# EAGLE design dongle (EAGLE 6.4)
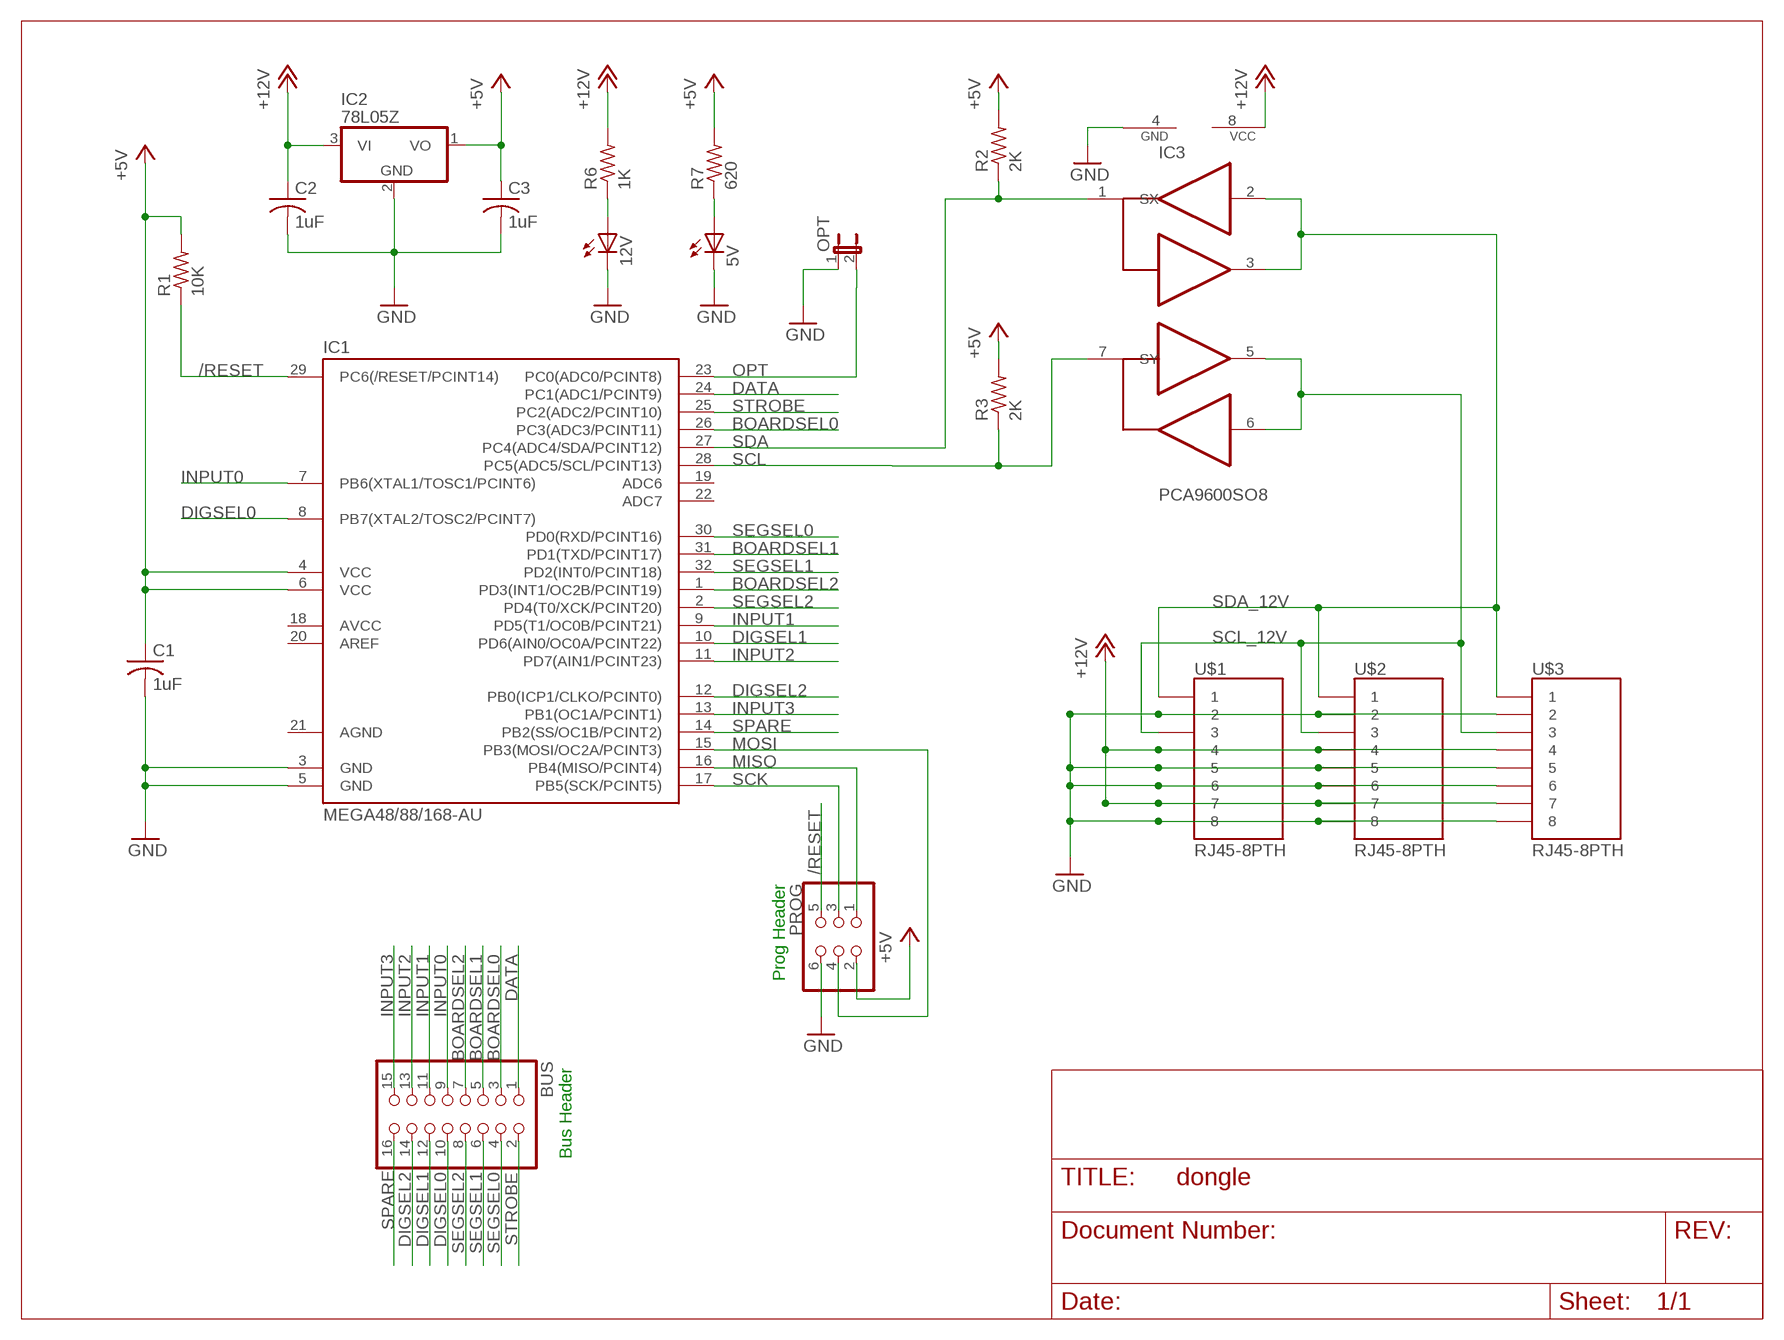
[diagram p0: schematic, sheet 1]

## Parts
5V  LED3MM  [LED3MM]
12V  LED3MM  [LED3MM]
BUS  PINHD-2X8  [2X08]
C1  1uF  C-US025-025X050  [C025-025X050]
C2  1uF  C-US025-025X050  [C025-025X050]
C3  1uF  C-US025-025X050  [C025-025X050]
IC1  MEGA48/88/168-AU  [TQFP32-08]
IC2  78L05Z  [TO92]
IC3  PCA9600SO8  [SO08]
OPT  JUMPER-2PTH  [1X02]
PROG  PINHD-2X3  [2X03]
R1  10K  R-US_0204/5  [0204/5]
R2  2K  R-US_0204/5  [0204/5]
R3  2K  R-US_0204/5  [0204/5]
R6  1K  R-US_0204/5  [0204/5]
R7  620  R-US_0204/5  [0204/5]
U$1  RJ45-8PTH  [RJ45-8]
U$2  RJ45-8PTH  [RJ45-8]
U$3  RJ45-8PTH  [RJ45-8]

## Nets
+5V [power]: C1.1 C3.1 IC1.4(VCC) IC1.6(VCC) IC2.1(VO) PROG.2 R1.2 R2.2 R3.2 R7.2
+12V [power]: C2.1 IC2.3(VI) IC3.8(VCC) R6.2 U$1.4 U$1.7 U$2.4 U$2.7 U$3.4 U$3.7
/RESET: IC1.29(PC6(/RESET/PCINT14)) PROG.5 R1.1
BOARDSEL0: BUS.3 IC1.26(PC3(ADC3/PCINT11))
BOARDSEL1: BUS.5 IC1.31(PD1(TXD/PCINT17))
BOARDSEL2: BUS.7 IC1.1(PD3(INT1/OC2B/PCINT19))
DATA: BUS.1 IC1.24(PC1(ADC1/PCINT9))
DIGSEL0: BUS.10 IC1.8(PB7(XTAL2/TOSC2/PCINT7))
DIGSEL1: BUS.12 IC1.10(PD6(AIN0/OC0A/PCINT22))
DIGSEL2: BUS.14 IC1.12(PB0(ICP1/CLKO/PCINT0))
GND [power]: 5V.K(C) 12V.K(C) C1.2 C2.2 C3.2 IC1.3(GND) IC1.5(GND) IC2.2(GND) IC3.4(GND) OPT.1 PROG.6 U$1.2 U$1.5 U$1.6 U$1.8 U$2.2 U$2.5 U$2.6 U$2.8 U$3.2 U$3.5 U$3.6 U$3.8
INPUT0: BUS.9 IC1.7(PB6(XTAL1/TOSC1/PCINT6))
INPUT1: BUS.11 IC1.9(PD5(T1/OC0B/PCINT21))
INPUT2: BUS.13 IC1.11(PD7(AIN1/PCINT23))
INPUT3: BUS.15 IC1.13(PB1(OC1A/PCINT1))
MISO: IC1.16(PB4(MISO/PCINT4)) PROG.1
MOSI: IC1.15(PB3(MOSI/OC2A/PCINT3)) PROG.4
N$1: 5V.A R7.1
N$2: 12V.A R6.1
OPT: IC1.23(PC0(ADC0/PCINT8)) OPT.2
SCK: IC1.17(PB5(SCK/PCINT5)) PROG.3
SCL: IC1.28(PC5(ADC5/SCL/PCINT13)) IC3.7(SY) R3.1
SCL_12V: IC3.5(TY) IC3.6(RY) U$1.3 U$2.3 U$3.3
SDA: IC1.27(PC4(ADC4/SDA/PCINT12)) IC3.1(SX) R2.1
SDA_12V: IC3.2(RX) IC3.3(TX) U$1.1 U$2.1 U$3.1
SEGSEL0: BUS.4 IC1.30(PD0(RXD/PCINT16))
SEGSEL1: BUS.6 IC1.32(PD2(INT0/PCINT18))
SEGSEL2: BUS.8 IC1.2(PD4(T0/XCK/PCINT20))
SPARE: BUS.16 IC1.14(PB2(SS/OC1B/PCINT2))
STROBE: BUS.2 IC1.25(PC2(ADC2/PCINT10))
Unconnected: IC1.18(AVCC) IC1.19(ADC6) IC1.20(AREF) IC1.22(ADC7)

## Notes on the sheet
- Prog Header
- Bus Header

## Power pins joined to a net without a drawn wire
AGND: IC1.21(AGND)

## Library data of the parts
5V 12V = led:LED: LED OSRAM: - CHIPLED LG R971, LG N971, LY N971, LG Q971, LY Q971, LO R971, LY R971 LH N974, LH R974 LS Q976, LO Q976, LY Q976 LO Q996 - Hyper CHIPLED LW Q18S LB Q993, LB Q99A, LB R99A - SideLED LS A670, LO A670, LY A670, LG A670, LP A670 LB A673, LV A673, LT A673, LW A673 LH A674 LY A675 LS A676, LA A676, LO A676, LY A676, LW A676 LS A679, LY A679, LG A679 - Hyper Micro SIDELED® LS Y876, LA Y876, LO Y876, LY Y876 LT Y87S - SmartLED LW L88C, LW L88S LB L89C, LB L89S, LG L890 LS L89K, LO L89K, LY L89K LS L896, LA L896, LO L896, LY L896 - TOPLED LS T670, LO T670, LY T670, LG T670, LP T670 LSG T670, LSP T670, LSY T670, LOP T670, LYG T670 LG T671, LOG T671, LSG T671 LB T673, LV T673, LT T673, LW T673 LH T674 LS T676, LA T676, LO T676, LY T676, LB T676, LH T676, LSB T676, LW T676 LB T67C, LV T67C, LT T67C, LS T67K, LO T67K, LY T67K, LW E67C LS E67B, LA E67B, LO E67B, LY E67B, LB E67C, LV E67C, LT E67C LW T67C LS T679, LY T679, LG T679 LS T770, LO T770, LY T770, LG T770, LP T770 LB T773, LV T773, LT T773, LW T773 LH T774 LS E675, LA E675, LY E675, LS T675 LS T776, LA T776, LO T776, LY T776, LB T776 LHGB T686 LT T68C, LB T68C - Hyper Mini TOPLED® LB M676 - Mini TOPLED Santana® LG M470 LS M47K, LO M47K, LY M47K Source: http://www.osram.convergy.de LUXEON: - LUMILED® LXK2-PW12-R00, LXK2-PW12-S00, LXK2-PW14-U00, LXK2-PW14-V00 LXK2-PM12-R00, LXK2-PM12-S00, LXK2-PM14-U00 LXK2-PE12-Q00, LXK2-PE12-R00, LXK2-PE12-S00, LXK2-PE14-T00, LXK2-PE14-U00 LXK2-PB12-K00, LXK2-PB12-L00, LXK2-PB12-M00, LXK2-PB14-N00, LXK2-PB14-P00, LXK2-PB14-Q00 LXK2-PR12-L00, LXK2-PR12-M00, LXK2-PR14-Q00, LXK2-PR14-R00 LXK2-PD12-Q00, LXK2-PD12-R00, LXK2-PD12-S00 LXK2-PH12-R00, LXK2-PH12-S00 LXK2-PL12-P00, LXK2-PL12-Q00, LXK2-PL12-R00 Source: www.luxeon.com KINGBRIGHT: KA-3528ASYC Source: www.kingbright.com
BUS = pinhead:PINHD-2X8: PIN HEADER
C1-C3 = rcl:C-US: CAPACITOR, American symbol
IC1 = avr-4:MEGA48/88/168
IC2 = linear:78*: Positive VOLTAGE REGULATOR Source: http://cache.national.com/ds/LM/LM78L05.pdf http://www.fairchildsemi.com/ds/LM/LM7805.pdf
IC3 = 4534_I2C2:PCA9600: I2C ACTIVE TERMINATOR SO-8
OPT = SparkFun:JUMPER-2: Jumper Basic 0.1" spaced jumper. Use with breakaway headers.
PROG = pinhead:PINHD-2X3: PIN HEADER
R1-R3 R6 R7 = rcl:R-US_: RESISTOR, American symbol
U$1-U$3 = SparkFun:RJ45-8: RJ45 Jack Simple RJ45, 8-pin connection - connector for common Cat5, Cat5e, and Cat6 Ethernet cables. Footprint not yet proven in production. Connector sku is PRT-00643; Breakout PCB sku is BOB-00716.

## Net classes
0 default: width 0.152 mm, drill 0.152 mm, clearance 0.152 mm
1 power: width 0.305 mm, drill 0.305 mm, clearance 0.152 mm to class 0, clearance 0.152 mm

## Board
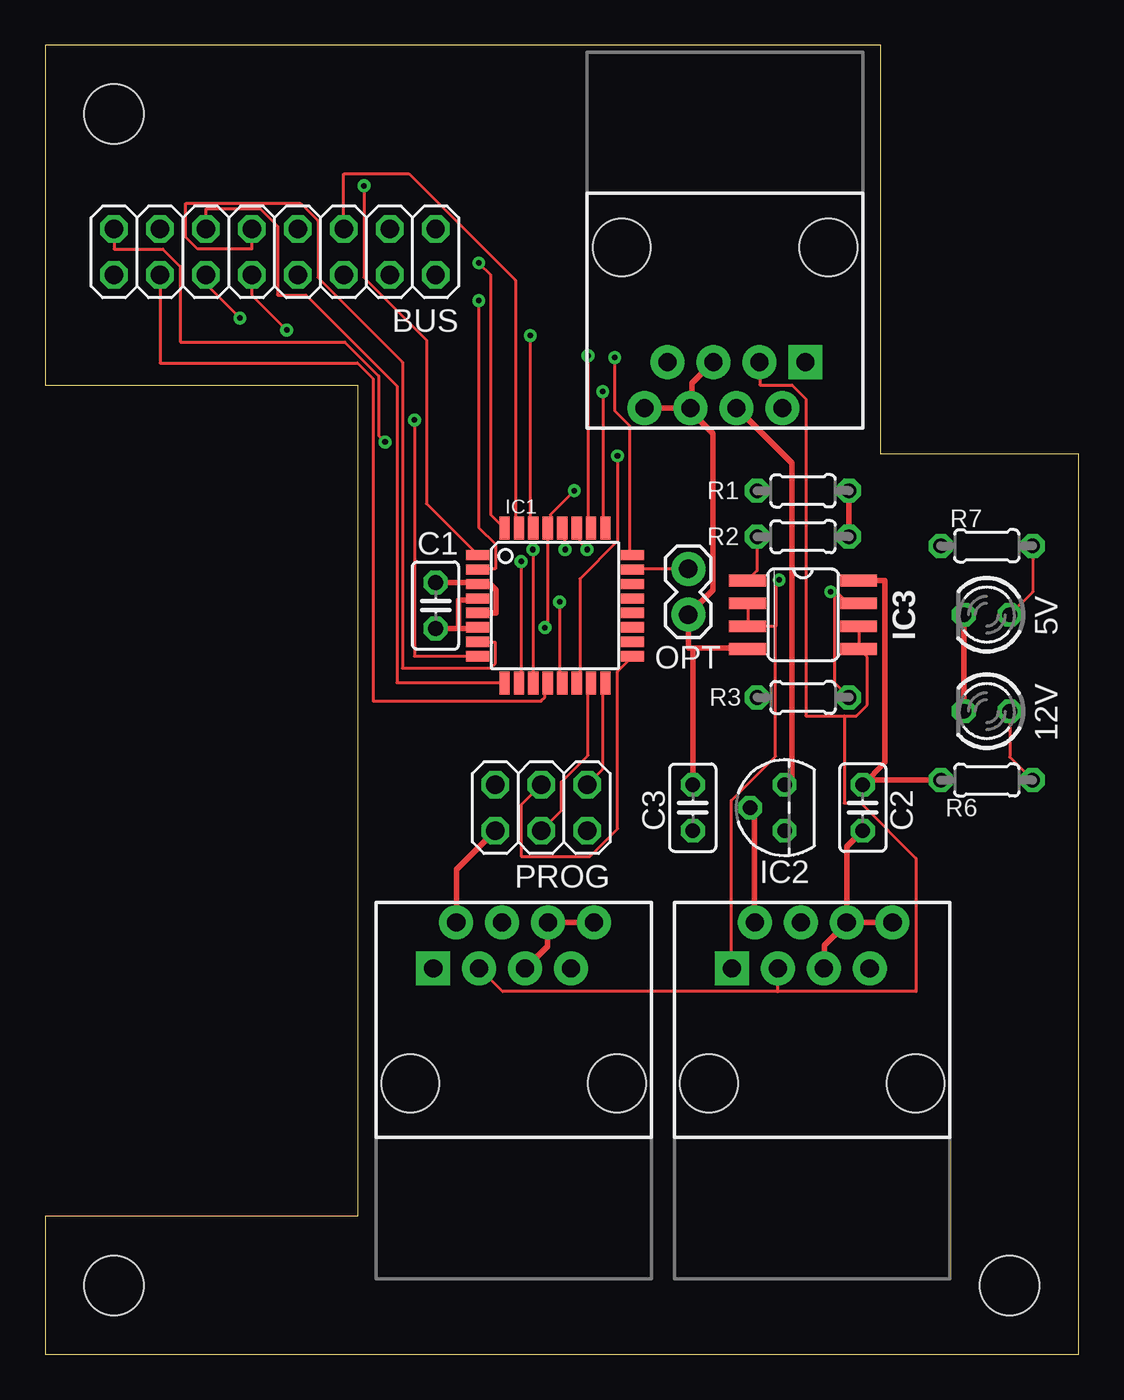
[diagram p1: board, top side]
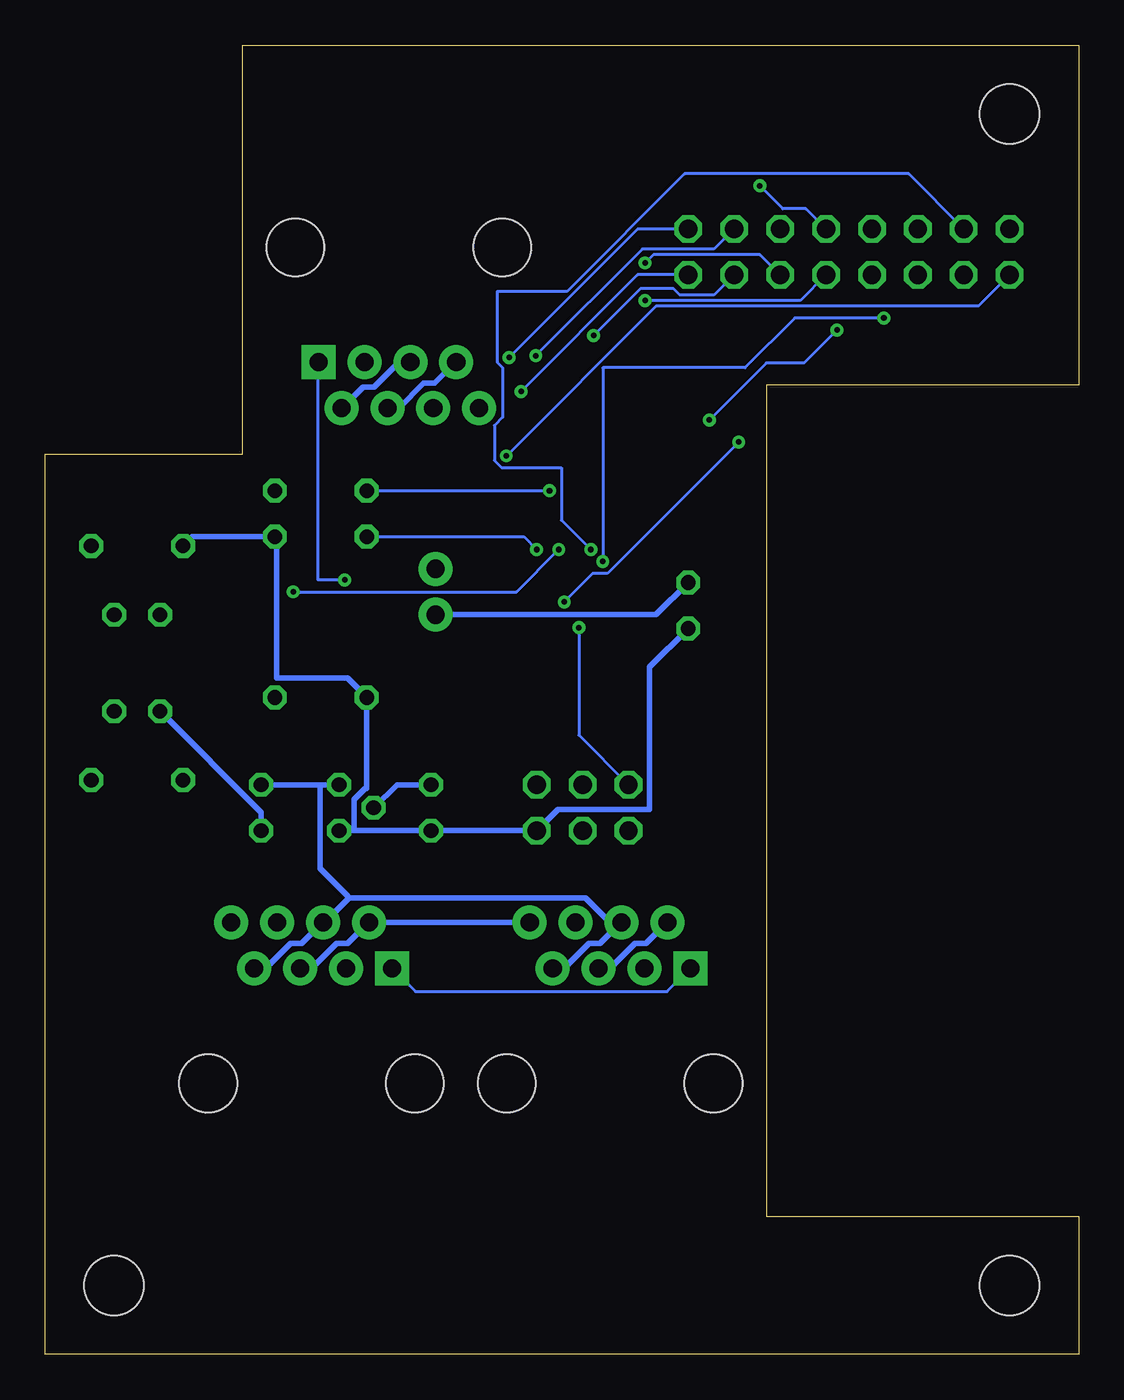
[diagram p2: board, bottom side, seen from below]

Size 57.15 x 72.39 mm. Coordinates in mm from the lower left corner, seen from the top.
Outline: 0,0 57.15,0 57.15,49.78 46.23,49.78 46.23,72.39 0,72.39 0,53.59 17.27,53.59 17.27,7.62 0,7.62 0,0
Copper layers (1*16): Top 0.035mm / dielectric 1.5mm / Bottom 0.035mm
Design rules "default *": minimum track width 6mil, minimum drill 12mil, track to track 6mil, track to pad 10mil, pad to pad 8mil, via to via 8mil, smd to smd 6mil, copper to edge 30mil, drill to drill 8mil, minimum pad ring 10mil, minimum via ring 8mil, stop-mask expansion 4mil, vias tented up to drill 0mil, thermal gap 10mil
vRestrict: area 2,57.7 to 23.6,64.3

### Footprints (pad centres in the part's own frame; a part is rotated, then mirrored left to right if it is on the bottom)
LED3MM = drill 0.813 octagon: A -1.27,0; K 1.27,0
2X08 = drill 1.016 octagon: 1 -8.89,-1.27; 2 -8.89,1.27; 3 -6.35,-1.27; 4 -6.35,1.27; 5 -3.81,-1.27; 6 -3.81,1.27; 7 -1.27,-1.27; 8 -1.27,1.27; 9 1.27,-1.27; 10 1.27,1.27; 11 3.81,-1.27; 12 3.81,1.27; 13 6.35,-1.27; 14 6.35,1.27; 15 8.89,-1.27; 16 8.89,1.27
C025-025X050 = drill 0.813 octagon: 1 -1.27,0; 2 1.27,0
TQFP32-08 = smd 1.27 x 0.559: 1 -4.293,2.8; 2 -4.293,2; 3 -4.293,1.2; 4 -4.293,0.4; 5 -4.293,-0.4; 6 -4.293,-1.2; 7 -4.293,-2; 8 -4.293,-2.8; 17 4.293,-2.8; 18 4.293,-2; 19 4.293,-1.2; 20 4.293,-0.4; 21 4.293,0.4; 22 4.293,1.2; 23 4.293,2; 24 4.293,2.8 | smd 0.559 x 1.27: 9 -2.8,-4.293; 10 -2,-4.293; 11 -1.2,-4.293; 12 -0.4,-4.293; 13 0.4,-4.293; 14 1.2,-4.293; 15 2,-4.293; 16 2.8,-4.293; 25 2.8,4.293; 26 2,4.293; 27 1.2,4.293; 28 0.4,4.293; 29 -0.4,4.293; 30 -1.2,4.293; 31 -2,4.293; 32 -2.8,4.293
TO92 = drill 0.813 octagon: 1 -1.27,0; 2 0,1.905; 3 1.27,0
SO08 = smd 0.66 x 2.032: 1 -1.905,-3.073; 2 -0.635,-3.073; 3 0.635,-3.073; 4 1.905,-3.073; 5 1.905,3.073; 6 0.635,3.073; 7 -0.635,3.073; 8 -1.905,3.073
1X02 = drill 1.016 pad 1.88: 1 0,0; 2 2.54,0
2X03 = drill 1.016 octagon: 1 -2.54,-1.27; 2 -2.54,1.27; 3 0,-1.27; 4 0,1.27; 5 2.54,-1.27; 6 2.54,1.27
0204/5 = drill 0.813 octagon: 1 -2.54,0; 2 2.54,0
RJ45-8 = drill 1 pad 1.88 square: 1 -4.445,6.35 | drill 1 pad 1.88: 2 -3.175,8.89; 3 -1.905,6.35; 4 -0.635,8.89; 5 0.635,6.35; 6 1.905,8.89; 7 3.175,6.35; 8 4.445,8.89 | hole 3.2: -5.715,0; 5.715,0
STAND-OFF = hole 3.302: 0,0

### Placement (x,y rotation side)
5V  52.07,40.89 180 top
12V  52.07,35.56 180 top
BUS  12.7,60.96 180 top
C1  21.59,41.4 90 top
C2  45.21,30.23 270 top
C3  35.81,30.23 90 top
IC1  28.19,41.4 0 top
IC2  40.89,30.23 90 top
IC3  41.91,40.89 270 top
OPT  35.56,40.89 90 top
PROG  27.43,30.23 180 top
R1  41.91,47.75 0 top
R2  41.91,45.21 0 top
R3  41.91,36.32 180 top
R6  52.07,31.75 180 top
R7  52.07,44.7 180 top
U$1  42.42,14.99 0 top
U$2  37.59,61.21 180 top
U$3  25.91,14.99 0 top
U$5  [STAND-OFF]  3.81,68.58 0 top
U$6  [STAND-OFF]  3.81,3.81 0 top
U$7  [STAND-OFF]  53.34,3.81 0 top

### Tracks (layer width: path | path; a pad name or v marks a point on that pad's centre or on a via)
+5V
  Top 0.305: R1.2 R2.2 | IC1.4 23.93,41.81 IC1.4 | IC1.6 23.93,40.18 IC1.6 | C1.1 22.86,40.13 | 22.86,40.13 23.77,40.13 IC1.6 | IC1.4 23.77,41.71 22.86,41.71 22.86,40.23 22.86,40.13
  Bottom 0.305: R7.2 49.02,45.21 R2.2 44.35,45.11 44.35,37.39 40.44,37.39 39.47,36.42 R3.2 39.37,31.29 39.47,31.29 40.08,30.68 40.08,29.06 40.08,28.96 | IC2.1 40.08,28.96 | 40.08,28.96 C3.1 35.71,28.96 PROG.2 29.87,29.06 28.8,30.12 23.72,30.12 23.72,38 C1.1
+12V
  Top 0.305: IC3.8 45.01,42.77 46.43,42.77 46.43,32.72 C2.1 45.67,31.75 R6.2 | IC2.3 41.3,31.9 41.3,49.28 38.25,52.32 U$2.4
  Bottom 0.305: U$3.7 29.06,21.34 28.45,21.34 27.08,22.71 26.47,22.71 25.3,23.88 U$3.4 25.7,23.67 27.28,25.25 40.34,25.25 | U$1.7 45.57,21.34 44.96,21.34 43.59,22.71 42.98,22.71 41.81,23.88 U$1.4 41.66,23.93 40.34,25.25 | U$2.7 34.44,54.86 35.61,53.7 36.22,53.7 37.59,52.32 38.2,52.32 U$2.4 | C2.1 41.96,31.5 | 41.96,31.5 IC2.3 | 40.34,25.25 40.44,25.35 41.96,26.87 41.96,31.39 41.96,31.5
/RESET  (via drill 0.3)
  Top 0.152: v29.26,47.75 27.94,46.43 27.94,45.82 27.84,45.72 IC1.29 27.79,45.62 27.79,40.34 v27.64,40.18
  Bottom 0.152: R1.1 v29.26,47.75 | PROG.5 27.64,34.24 v27.64,40.18
BOARDSEL0  (via drill 0.3)
  Top 0.152: v30.02,55.22 30.02,45.87 30.18,45.72 IC1.26
  Bottom 0.152: v30.02,55.22 24.13,61.11 20.17,61.11 BUS.3
BOARDSEL1
  Top 0.152: BUS.5 16.51,65.28 20.12,65.28 26.01,59.38 26.01,45.87 26.16,45.72 IC1.31
BOARDSEL2  (via drill 0.3)
  Top 0.152: v17.63,64.62 17.63,59.54 21.08,56.08 21.08,47.04 23.88,44.25 IC1.1
  Bottom 0.152: v17.63,64.62 16.36,63.35 15.09,63.35 BUS.7
DATA  (via drill 0.3)
  Top 0.152: v31.5,55.12 31.5,52.17 32.31,51.36 32.31,44.4 32.46,44.25 IC1.24
  Bottom 0.152: v31.5,55.12 24.38,62.23 BUS.1
DIGSEL0  (via drill 0.3)
  Top 0.152: v20.42,51.66 20.42,38.61 23.88,38.61 IC1.8 | v13.36,56.64 11.43,58.57 BUS.10
  Bottom 0.152: v20.42,51.66 17.27,54.81 15.19,54.81 v13.36,56.64
DIGSEL1  (via drill 0.3)
  Top 0.152: v26.31,43.84 26.31,37.24 26.21,37.13 IC1.10 | v10.77,57.3 8.89,59.18 BUS.12
  Bottom 0.152: v26.31,43.84 26.31,54.56 18.44,54.56 15.7,57.3 v10.77,57.3
DIGSEL2
  Top 0.152: BUS.14 6.35,54.81 17.27,54.81 18.14,53.95 18.14,36.12 27.43,36.12 27.64,36.32 27.64,36.93 27.79,37.08 IC1.12
GND
  Top 0.305: U$2.8 33.17,52.32 35.66,52.32 U$2.6 | U$2.5 36.93,54.86 35.76,53.7 35.76,52.43 U$2.6 | IC1.5 23.93,41 IC1.5 | IC1.5 24.08,41 24.94,41 24.94,42.27 24.64,42.57 23.93,42.57 IC1.3 | IC1.3 23.93,42.62 IC1.3 | C1.2 23.77,42.67 IC1.3 | IC3.4 38.86,39.01 IC3.4 | 35.81,39.06 35.56,39.06 OPT.1 35.66,41 36.93,42.27 36.93,50.9 35.66,52.17 U$2.6 | 35.81,39.06 38.71,39.06 IC3.4 | 5V.K 12V.K | C2.2 44.35,28.09 44.35,23.88 U$1.6 | U$1.8 46.84,23.88 44.45,23.88 U$1.6 | PROG.6 22.76,26.82 22.76,23.88 U$3.2 | U$3.5 26.57,21.34 27.79,22.55 27.79,23.88 U$3.6 27.94,23.88 30.33,23.88 U$3.8 | IC2.2 39.01,30.23 39.22,30.02 39.22,23.88 U$1.2 | U$1.6 44.25,23.77 43.08,22.61 43.08,21.34 U$1.5 | C3.2 35.81,38.96 35.81,39.06
  Bottom 0.305: U$2.2 40.74,52.32 39.57,53.49 38.96,53.49 37.59,54.86 36.98,54.86 U$2.5 | C1.2 23.37,40.89 OPT.1 | 12V.K 45.21,29.97 C2.2 | U$3.2 22.76,23.88 23.93,22.71 24.54,22.71 25.91,21.34 26.52,21.34 U$3.5 | C3.2 37.69,31.5 38.96,30.23 IC2.2 | U$1.5 43.03,21.34 42.42,21.34 41.05,22.71 40.44,22.71 39.27,23.88 U$1.2 39.12,23.88 30.38,23.88 U$3.8
INPUT0
  Top 0.152: BUS.9 11.43,61.11 8.43,61.11 7.77,61.77 7.77,63.65 14.12,63.65 15.09,62.69 15.09,59.54 19.76,54.86 19.76,37.95 24.64,37.95 24.89,38.2 24.89,39.37 23.93,39.37 IC1.7
INPUT1
  Top 0.152: BUS.11 8.89,63.35 11.89,63.35 12.85,62.38 12.85,58.57 14.43,58.57 19.46,53.54 19.46,37.13 25.35,37.13 IC1.9
INPUT2  (via drill 0.3)
  Top 0.152: v26.98,44.5 26.98,37.13 IC1.11
  Bottom 0.152: v26.98,44.5 28.6,46.13 28.6,49.02 31.9,49.02 32.31,49.43 32.31,51.36 31.85,51.82 31.85,54.56 32.16,54.86 32.16,58.78 28.3,58.78 21.79,65.28 9.4,65.28 BUS.13
INPUT3  (via drill 0.3)
  Top 0.152: v28.45,41.6 28.45,37.24 28.55,37.13 IC1.13 | v18.8,50.44 18.44,50.8 18.44,54.1 16.56,55.98 7.47,55.98 7.47,60.15 6.5,61.11 3.81,61.11 BUS.15
  Bottom 0.152: v28.45,41.6 26.87,43.18 26.06,43.18 v18.8,50.44
MISO
  Top 0.152: PROG.1 30.84,32.36 30.84,36.93 30.99,37.08 IC1.16
MOSI
  Top 0.152: PROG.4 28.55,30.07 28.55,31.65 30.02,33.12 30.02,36.93 30.18,37.08 IC1.15
N$1
  Top 0.152: 5V.A 54.61,42.16 R7.1
N$2
  Top 0.152: R6.1 53.34,33.02 12V.A
OPT
  Top 0.152: OPT.2 32.51,43.43 IC1.23
SCK
  Top 0.152: PROG.3 26.31,30.38 26.31,27.53 30.12,27.53 31.65,29.06 31.65,37.74 32.46,38.56 IC1.17
SCL  (via drill 0.3)
  Top 0.152: v28.75,44.5 28.75,45.52 28.6,45.67 IC1.28 | IC3.7 44.96,41.55 44.4,41.55 43.79,42.16 v43.43,42.16 43.64,42.11 43.64,37.13 R3.1
  Bottom 0.152: v28.75,44.5 31.09,42.16 v43.43,42.16
SCL_12V
  Top 0.152: 40.49,20.07 25.3,20.07 24.03,21.34 U$3.3 | 40.49,20.07 40.49,21.34 U$1.3 | IC3.6 45.01,40.23 45.01,39.01 IC3.5 45.06,38.96 45.47,38.56 45.47,35.92 44.86,35.31 44.2,35.31 | 44.2,35.31 42.06,35.31 42.06,52.83 41.3,53.59 39.52,53.59 39.52,54.86 U$2.3 | 40.49,20.07 40.54,20.07 48.16,20.07 48.16,27.43 45.11,30.48 44.2,30.48 44.2,35.26 44.2,35.31
SDA  (via drill 0.3)
  Top 0.152: v29.97,44.5 29.57,44.91 29.57,45.52 29.41,45.67 IC1.27 | R2.1 39.37,43.33 38.86,42.82 IC3.1
  Bottom 0.152: v29.97,44.5 30.68,45.21 R2.1
SDA_12V  (via drill 0.3)
  Top 0.152: IC3.2 38.86,41.5 38.86,40.28 IC3.3 38.91,40.23 40.39,40.23 | 40.39,40.23 40.39,33.07 37.95,30.63 37.95,21.34 U$1.1 | v40.59,42.82 40.44,42.67 40.44,40.28 40.39,40.23
  Bottom 0.152: U$3.1 21.49,21.34 22.76,20.07 36.68,20.07 37.95,21.34 U$1.1 | v40.59,42.82 42.06,42.82 42.06,54.86 U$2.1
SEGSEL0  (via drill 0.3)
  Top 0.152: v26.82,56.34 26.82,45.87 26.98,45.72 IC1.30
  Bottom 0.152: v26.82,56.34 24.23,58.93 22.4,58.93 22.05,58.57 20.17,58.57 BUS.4
SEGSEL1  (via drill 0.3)
  Top 0.152: v23.98,60.35 24.64,59.69 24.64,46.43 25.35,45.72 IC1.32
  Bottom 0.152: v23.98,60.35 23.52,60.81 17.63,60.81 BUS.6
SEGSEL2  (via drill 0.3)
  Top 0.152: v23.98,58.27 23.98,45.72 24.89,44.81 24.89,43.43 23.93,43.43 IC1.2
  Bottom 0.152: v23.98,58.27 15.39,58.27 BUS.8
SPARE  (via drill 0.3)
  Top 0.152: v31.65,49.68 31.65,44.96 29.57,42.88 29.57,37.29 29.41,37.13 IC1.14
  Bottom 0.152: v31.65,49.68 23.37,57.96 5.54,57.96 BUS.16
STROBE  (via drill 0.3)
  Top 0.152: v30.84,53.24 30.84,45.87 30.99,45.72 IC1.25
  Bottom 0.152: v30.84,53.24 24.38,59.69 BUS.2

### Text on the board
tDocu: EXPERIMENTAL | Not certified for flight / beyond termination shock | 1 | 1 | EPB-I2C Dongle Rev A | Sep 2017